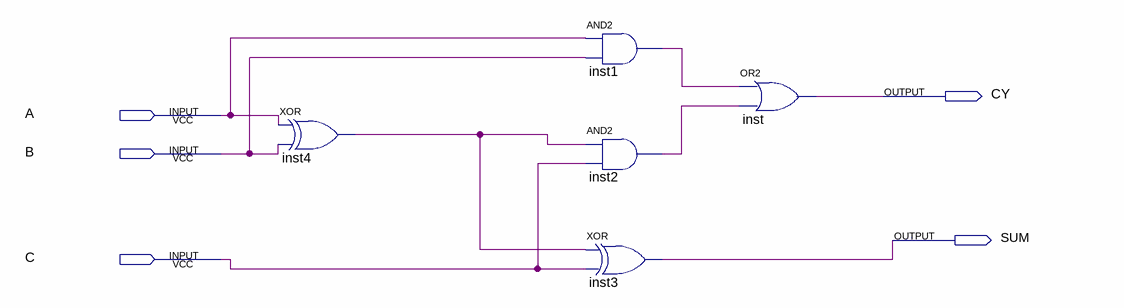
[diagram p0: schematic sheet]
// Quartus schematic adder_full.bdf as structural Verilog: 5 symbols, 5 pins
module adder_full (
  input  A,
  input  B,
  input  C,
  output CY,
  output SUM
);

  wire inst1_out, inst2_out, inst4_out;

  xor inst4 (inst4_out, A, B);
  and inst1 (inst1_out, A, B);
  and inst2 (inst2_out, inst4_out, C);
  xor inst3 (SUM, inst4_out, C);
  or inst (CY, inst1_out, inst2_out);
endmodule
